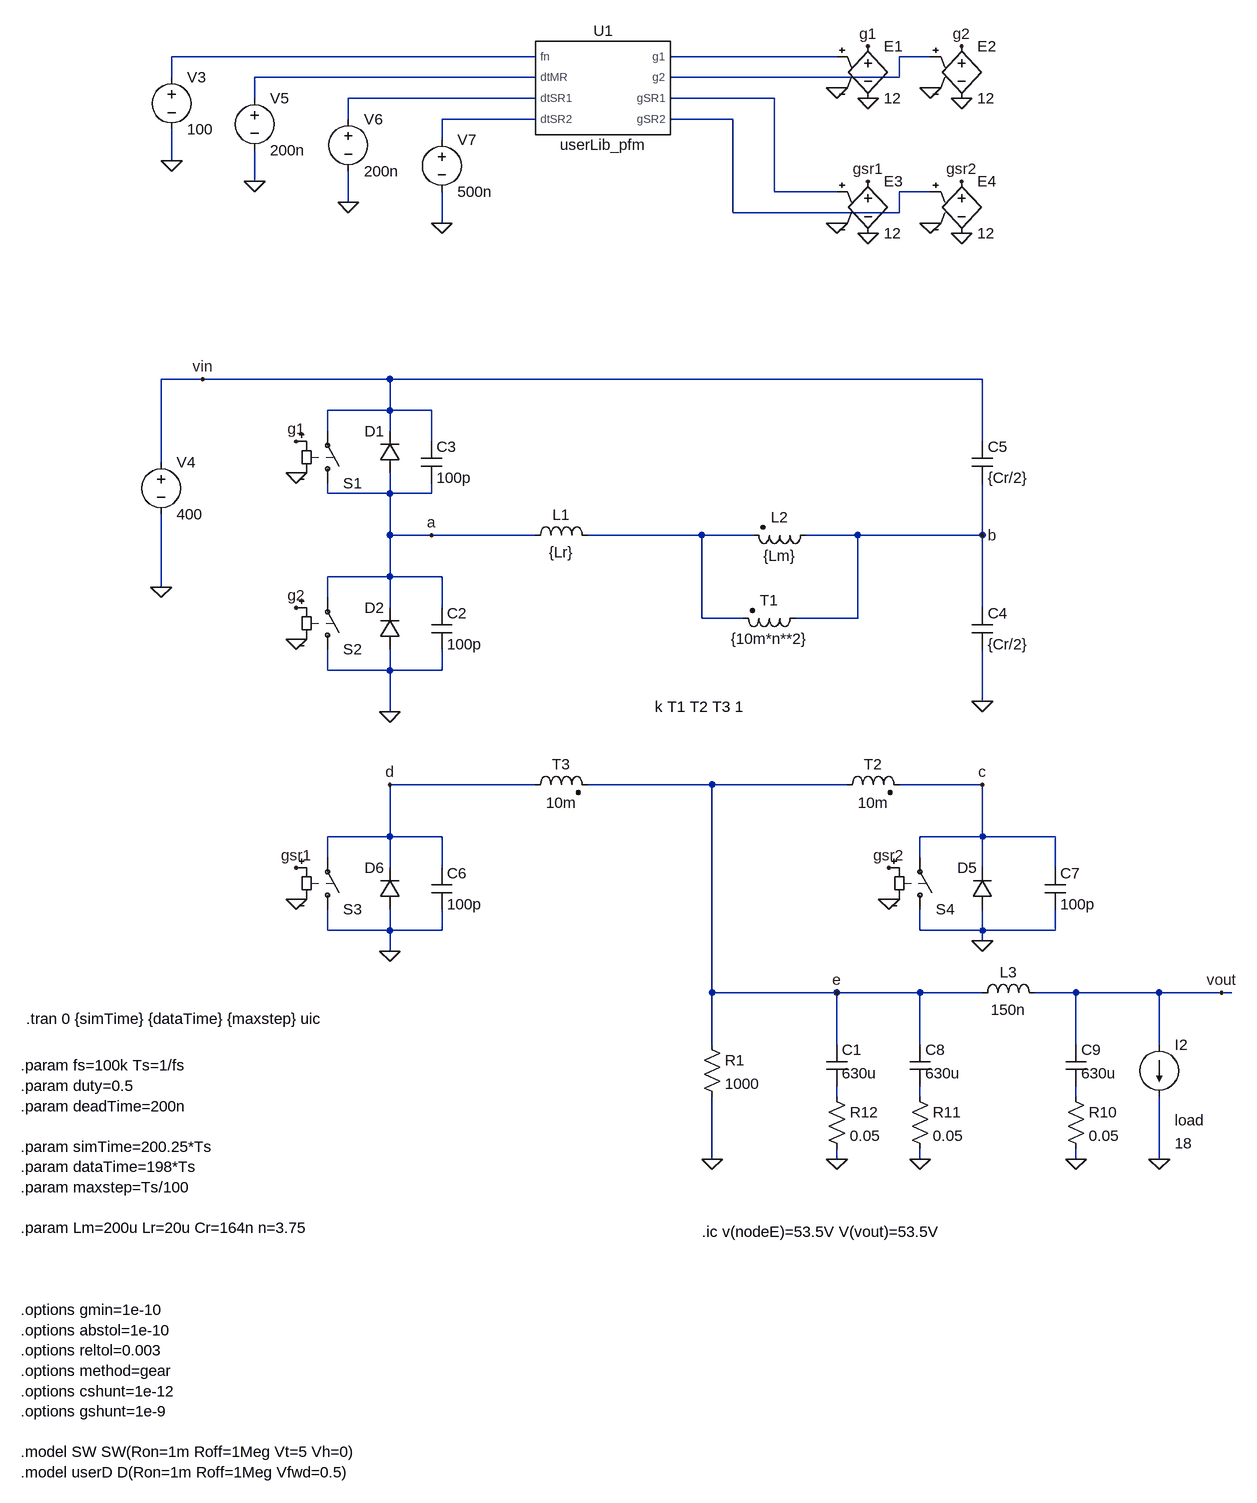
[diagram p0: schematic llc02.asc]
llc02.asc, the LTspice schematic file:
Version 4.1
SHEET 1 3076 3708
WIRE -400 368 -960 368
WIRE 64 368 -192 368
WIRE 208 368 160 368
WIRE -960 400 -960 368
WIRE -400 400 -832 400
WIRE 160 400 160 368
WIRE 160 400 -192 400
WIRE -832 432 -832 400
WIRE -400 432 -688 432
WIRE -32 432 -192 432
WIRE -688 464 -688 432
WIRE -400 464 -544 464
WIRE -96 464 -192 464
WIRE -544 496 -544 464
WIRE -960 528 -960 480
WIRE -832 560 -832 512
WIRE -32 576 -32 432
WIRE 64 576 -32 576
WIRE 208 576 160 576
WIRE -688 592 -688 544
WIRE -96 608 -96 464
WIRE 160 608 160 576
WIRE 160 608 -96 608
WIRE -544 624 -544 576
WIRE -912 864 -976 864
WIRE -624 864 -912 864
WIRE 288 864 -624 864
WIRE -624 912 -624 864
WIRE -624 912 -720 912
WIRE -560 912 -624 912
WIRE -720 944 -720 912
WIRE -624 944 -624 912
WIRE -560 960 -560 912
WIRE 288 960 288 864
WIRE -976 992 -976 864
WIRE -720 1040 -720 1024
WIRE -624 1040 -624 1008
WIRE -624 1040 -720 1040
WIRE -560 1040 -560 1024
WIRE -560 1040 -624 1040
WIRE -624 1104 -624 1040
WIRE -560 1104 -624 1104
WIRE -400 1104 -560 1104
WIRE -144 1104 -320 1104
WIRE -64 1104 -144 1104
WIRE 96 1104 16 1104
WIRE 288 1104 288 1024
WIRE 288 1104 96 1104
WIRE -624 1168 -624 1104
WIRE -624 1168 -720 1168
WIRE -544 1168 -624 1168
WIRE -976 1184 -976 1072
WIRE -720 1200 -720 1168
WIRE -624 1216 -624 1168
WIRE -544 1216 -544 1168
WIRE 288 1216 288 1104
WIRE -144 1232 -144 1104
WIRE -80 1232 -144 1232
WIRE 96 1232 96 1104
WIRE 96 1232 0 1232
WIRE -720 1312 -720 1280
WIRE -624 1312 -624 1280
WIRE -624 1312 -720 1312
WIRE -544 1312 -544 1280
WIRE -544 1312 -624 1312
WIRE 288 1360 288 1280
WIRE -624 1376 -624 1312
WIRE -400 1488 -624 1488
WIRE -128 1488 -320 1488
WIRE 80 1488 -128 1488
WIRE 288 1488 160 1488
WIRE -624 1568 -624 1488
WIRE -624 1568 -720 1568
WIRE -544 1568 -624 1568
WIRE 288 1568 288 1488
WIRE 288 1568 192 1568
WIRE 400 1568 288 1568
WIRE -720 1600 -720 1568
WIRE 192 1600 192 1568
WIRE -624 1616 -624 1568
WIRE -544 1616 -544 1568
WIRE 288 1616 288 1568
WIRE 400 1616 400 1568
WIRE -720 1712 -720 1680
WIRE -624 1712 -624 1680
WIRE -624 1712 -720 1712
WIRE -544 1712 -544 1680
WIRE -544 1712 -624 1712
WIRE 192 1712 192 1680
WIRE 288 1712 288 1680
WIRE 288 1712 192 1712
WIRE 400 1712 400 1680
WIRE 400 1712 288 1712
WIRE 288 1728 288 1712
WIRE -624 1744 -624 1712
WIRE -128 1808 -128 1488
WIRE 64 1808 -128 1808
WIRE 192 1808 64 1808
WIRE 288 1808 192 1808
WIRE 432 1808 368 1808
WIRE 560 1808 432 1808
WIRE 656 1808 560 1808
WIRE 672 1808 656 1808
WIRE -128 1888 -128 1808
WIRE 64 1888 64 1808
WIRE 192 1888 192 1808
WIRE 432 1888 432 1808
WIRE 560 1888 560 1808
WIRE 64 1968 64 1952
WIRE 192 1968 192 1952
WIRE 432 1968 432 1952
WIRE -128 2064 -128 1968
WIRE 64 2064 64 2048
WIRE 192 2064 192 2048
WIRE 432 2064 432 2048
WIRE 560 2064 560 1968
FLAG -624 1376 0
FLAG 64 2064 0
FLAG -128 2064 0
FLAG -560 1104 a
FLAG -976 1184 0
FLAG 288 1728 0
FLAG -624 1744 0
FLAG 656 1808 vout
FLAG -912 864 vin
FLAG 288 1488 c
FLAG -624 1488 d
FLAG 288 1360 0
FLAG -768 1008 0
FLAG -768 960 g1
FLAG -768 1264 0
FLAG -768 1216 g2
FLAG 288 1104 b
FLAG 192 2064 0
FLAG 432 2064 0
FLAG 64 1808 e
FLAG 560 2064 0
FLAG -960 528 0
FLAG -832 560 0
FLAG -688 592 0
FLAG -544 624 0
FLAG 112 352 g1
FLAG 112 432 0
FLAG 64 416 0
FLAG 256 352 g2
FLAG 256 432 0
FLAG 208 416 0
FLAG 112 560 gsr1
FLAG 112 640 0
FLAG 64 624 0
FLAG 256 560 gsr2
FLAG 256 640 0
FLAG 208 624 0
FLAG -768 1664 0
FLAG -768 1616 gsr1
FLAG 144 1664 0
FLAG 144 1616 gsr2
SYMBOL diode -608 1008 R180
WINDOW 0 24 64 Left 2
WINDOW 3 24 0 Invisible 2
SYMATTR InstName D1
SYMATTR Value userD
SYMBOL cap 48 1888 R0
WINDOW 3 24 44 Left 2
SYMATTR Value 630u
SYMATTR InstName C1
SYMBOL res -144 1872 R0
SYMATTR InstName R1
SYMATTR Value 1000
SYMBOL voltage -976 976 R0
SYMATTR InstName V4
SYMATTR Value 400
SYMBOL diode -608 1280 R180
WINDOW 0 24 64 Left 2
WINDOW 3 24 0 Invisible 2
SYMATTR InstName D2
SYMATTR Value userD
SYMBOL ind -416 1120 R270
WINDOW 0 32 56 VTop 2
WINDOW 3 5 56 VBottom 2
SYMATTR InstName L1
SYMATTR Value {Lr}
SYMATTR SpiceLine Rser=1m
SYMBOL cap 272 960 R0
SYMATTR InstName C5
SYMATTR Value {Cr/2}
SYMBOL ind2 32 1088 R90
WINDOW 0 4 56 VBottom 2
WINDOW 3 32 56 VTop 2
SYMATTR InstName L2
SYMATTR Value {Lm}
SYMATTR Type ind
SYMBOL ind2 64 1504 R270
WINDOW 0 32 56 VTop 2
WINDOW 3 4 56 VBottom 2
SYMATTR InstName T2
SYMATTR Value 10m
SYMATTR SpiceLine Rser=1m
SYMATTR Type ind
SYMBOL ind2 -416 1504 R270
WINDOW 0 32 56 VTop 2
WINDOW 3 4 56 VBottom 2
SYMATTR InstName T3
SYMATTR Value 10m
SYMATTR SpiceLine Rser=1m
SYMATTR Type ind
SYMBOL diode 304 1680 R180
WINDOW 0 24 64 Left 2
WINDOW 3 24 0 Invisible 2
SYMATTR InstName D5
SYMATTR Value userD
SYMBOL diode -608 1680 R180
WINDOW 0 24 64 Left 2
WINDOW 3 24 0 Invisible 2
SYMATTR InstName D6
SYMATTR Value userD
SYMBOL ind2 16 1216 R90
WINDOW 0 4 56 VBottom 2
WINDOW 3 32 56 VTop 2
SYMATTR InstName T1
SYMATTR Value {10m*n**2}
SYMATTR Type ind
SYMBOL cap 272 1216 R0
SYMATTR InstName C4
SYMATTR Value {Cr/2}
SYMBOL sw -720 1040 M180
WINDOW 3 24 -20 Invisible 2
SYMATTR InstName S1
SYMBOL ind 272 1824 R270
WINDOW 0 32 56 VTop 2
WINDOW 3 5 56 VBottom 2
SYMATTR InstName L3
SYMATTR Value 150n
SYMBOL current 560 1888 R0
WINDOW 3 24 152 Left 2
WINDOW 123 0 0 Left 0
WINDOW 39 24 116 Left 2
SYMATTR Value 18
SYMATTR SpiceLine load
SYMATTR InstName I2
SYMBOL res 416 1952 R0
SYMATTR InstName R10
SYMATTR Value 0.05
SYMBOL res 176 1952 R0
SYMATTR InstName R11
SYMATTR Value 0.05
SYMBOL res 48 1952 R0
SYMATTR InstName R12
SYMATTR Value 0.05
SYMBOL cap -576 960 R0
SYMATTR InstName C3
SYMATTR Value 100p
SYMBOL sw -720 1296 M180
WINDOW 3 24 -20 Invisible 2
SYMATTR InstName S2
SYMBOL cap -560 1216 R0
SYMATTR InstName C2
SYMATTR Value 100p
SYMBOL cap -560 1616 R0
SYMATTR InstName C6
SYMATTR Value 100p
SYMBOL cap 384 1616 R0
SYMATTR InstName C7
SYMATTR Value 100p
SYMBOL cap 176 1888 R0
WINDOW 3 24 44 Left 2
SYMATTR Value 630u
SYMATTR InstName C8
SYMBOL cap 416 1888 R0
WINDOW 3 24 44 Left 2
SYMATTR Value 630u
SYMATTR InstName C9
SYMBOL userLib_pfm -320 416 R0
SYMATTR InstName U1
SYMBOL voltage -960 384 R0
WINDOW 123 0 0 Left 0
WINDOW 39 0 0 Left 0
SYMATTR InstName V3
SYMATTR Value 100
SYMBOL voltage -832 416 R0
WINDOW 123 0 0 Left 0
WINDOW 39 0 0 Left 0
SYMATTR InstName V5
SYMATTR Value 200n
SYMBOL voltage -688 448 R0
WINDOW 123 0 0 Left 0
WINDOW 39 0 0 Left 0
SYMATTR InstName V6
SYMATTR Value 200n
SYMBOL voltage -544 480 R0
WINDOW 123 0 0 Left 0
WINDOW 39 0 0 Left 0
SYMATTR InstName V7
SYMATTR Value 500n
SYMBOL e 112 336 R0
SYMATTR InstName E1
SYMATTR Value 12
SYMBOL e 256 336 R0
SYMATTR InstName E2
SYMATTR Value 12
SYMBOL e 112 544 R0
SYMATTR InstName E3
SYMATTR Value 12
SYMBOL e 256 544 R0
SYMATTR InstName E4
SYMATTR Value 12
SYMBOL sw -720 1696 M180
WINDOW 3 24 -20 Invisible 2
SYMATTR InstName S3
SYMBOL sw 192 1696 M180
WINDOW 3 24 -20 Invisible 2
SYMATTR InstName S4
TEXT -1192 1920 Left 2 !.param fs=100k Ts=1/fs\n.param duty=0.5\n.param deadTime=200n\n \n.param simTime=200.25*Ts\n.param dataTime=198*Ts\n.param maxstep=Ts/100\n \n.param Lm=200u Lr=20u Cr=164n n=3.75
TEXT -1184 1848 Left 2 !.tran 0 {simTime} {dataTime} {maxstep} uic
TEXT -216 1368 Left 2 !k T1 T2 T3 1
TEXT -1192 2296 Left 2 !.options gmin=1e-10\n.options abstol=1e-10\n.options reltol=0.003\n.options method=gear\n.options cshunt=1e-12\n.options gshunt=1e-9\n \n.model SW SW(Ron=1m Roff=1Meg Vt=5 Vh=0)\n.model userD D(Ron=1m Roff=1Meg Vfwd=0.5)
TEXT -144 2176 Left 2 !.ic v(nodeE)=53.5V V(vout)=53.5V

The netlist it stands for:
* llc02.asc
D1 a vin userD
C1 e N010 630u
R1 e 0 1000
V4 vin 0 400
D2 0 a userD
L1 a N009 {Lr} Rser=1m
C5 vin b {Cr/2}
L2 b N009 {Lm}
L§T2 e c 10m Rser=1m
L§T3 d e 10m Rser=1m
D5 0 c userD
D6 0 d userD
L§T1 b N009 {10m*n**2}
C4 b 0 {Cr/2}
S1 a vin g1 0 SW
L3 e vout 150n
I2 vout 0 18 load
R10 N012 0 0.05
R11 N011 0 0.05
R12 N010 0 0.05
C3 vin a 100p
S2 0 a g2 0 SW
C2 a 0 100p
C6 d 0 100p
C7 c 0 100p
C8 e N011 630u
C9 vout N012 630u
X§U1 N001 N004 N005 N007 N002 N003 N006 N008 userLib_pfm  ; pins fn dtMR dtSR1 dtSR2 g1 g2 gSR1 gSR2
V3 N001 0 100
V5 N004 0 200n
V6 N005 0 200n
V7 N007 0 500n
E1 g1 0 N002 0 12
E2 g2 0 N003 0 12
E3 gsr1 0 N006 0 12
E4 gsr2 0 N008 0 12
S3 0 d gsr1 0 SW
S4 0 c gsr2 0 SW
.model D D
.lib standard.dio
.param fs=100k Ts=1/fs
.param duty=0.5
.param deadTime=200n
.param simTime=200.25*Ts
.param dataTime=198*Ts
.param maxstep=Ts/100
.param Lm=200u Lr=20u Cr=164n n=3.75
.tran 0 {simTime} {dataTime} {maxstep} uic
k T1 T2 T3 1
.options gmin=1e-10
.options abstol=1e-10
.options reltol=0.003
.options method=gear
.options cshunt=1e-12
.options gshunt=1e-9
.model SW SW(Ron=1m Roff=1Meg Vt=5 Vh=0)
.model userD D(Ron=1m Roff=1Meg Vfwd=0.5)
.ic v(nodeE)=53.5V V(vout)=53.5V
.lib userLib_pfm.sub
.backanno
.end